# EAGLE board NN22_RPi_DetAdapter03_s00 (EAGLE 7.7.0)
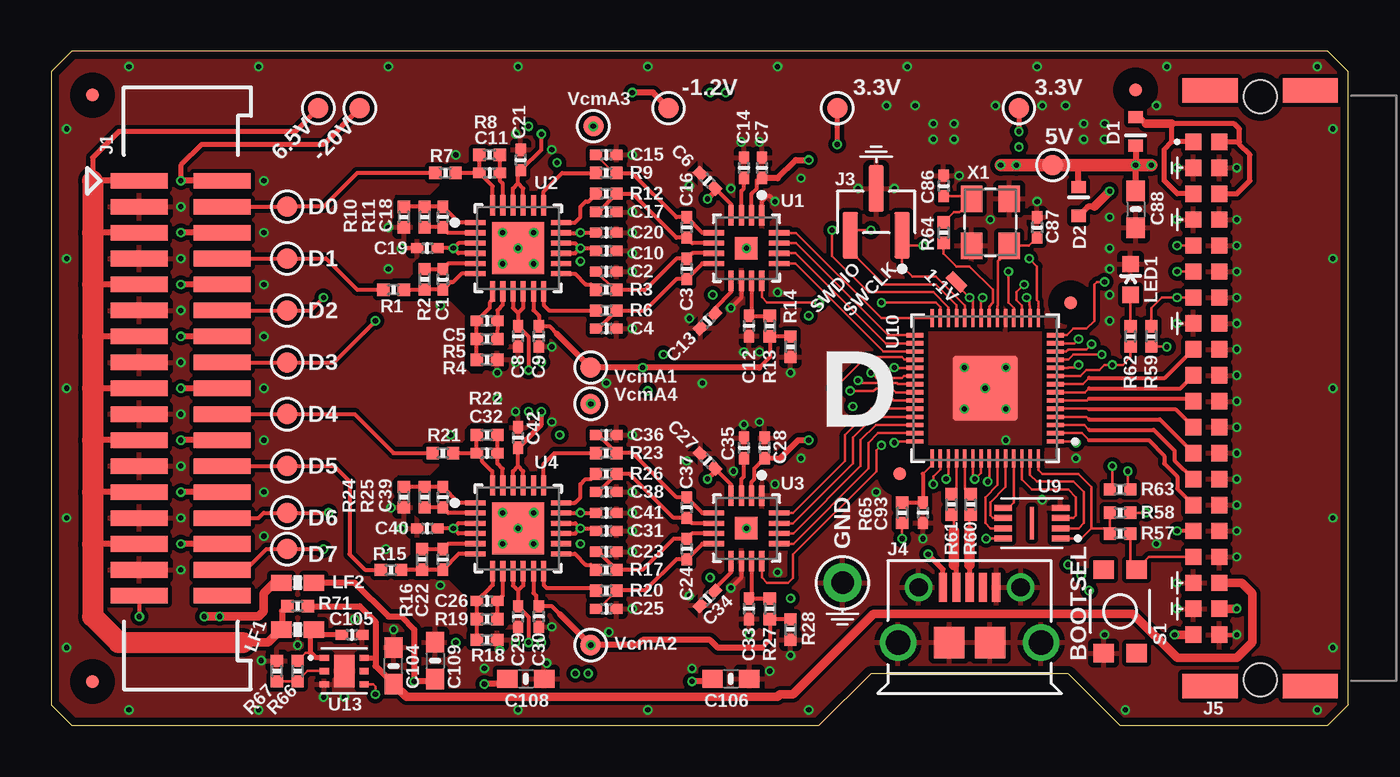
[diagram p6: board, top side]
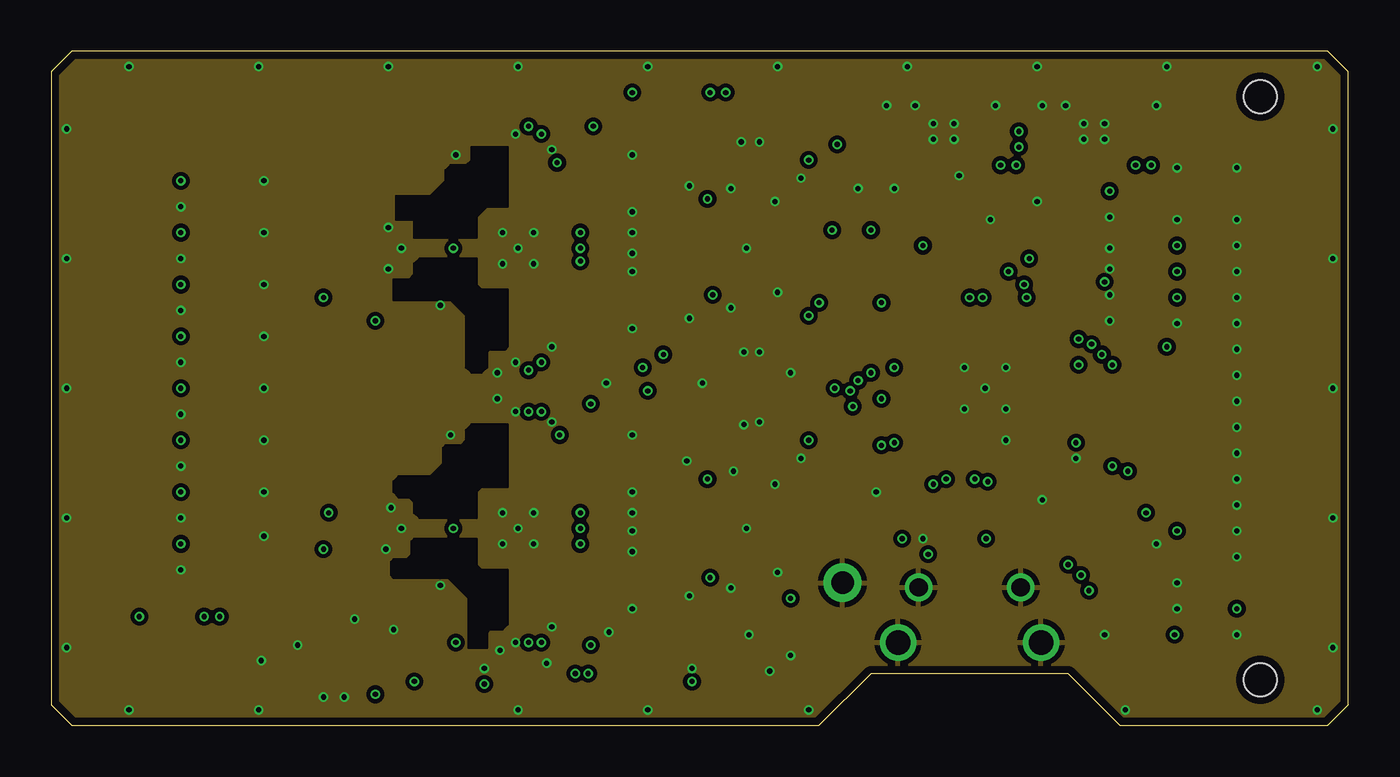
[diagram p7: board, inner layer Route2]
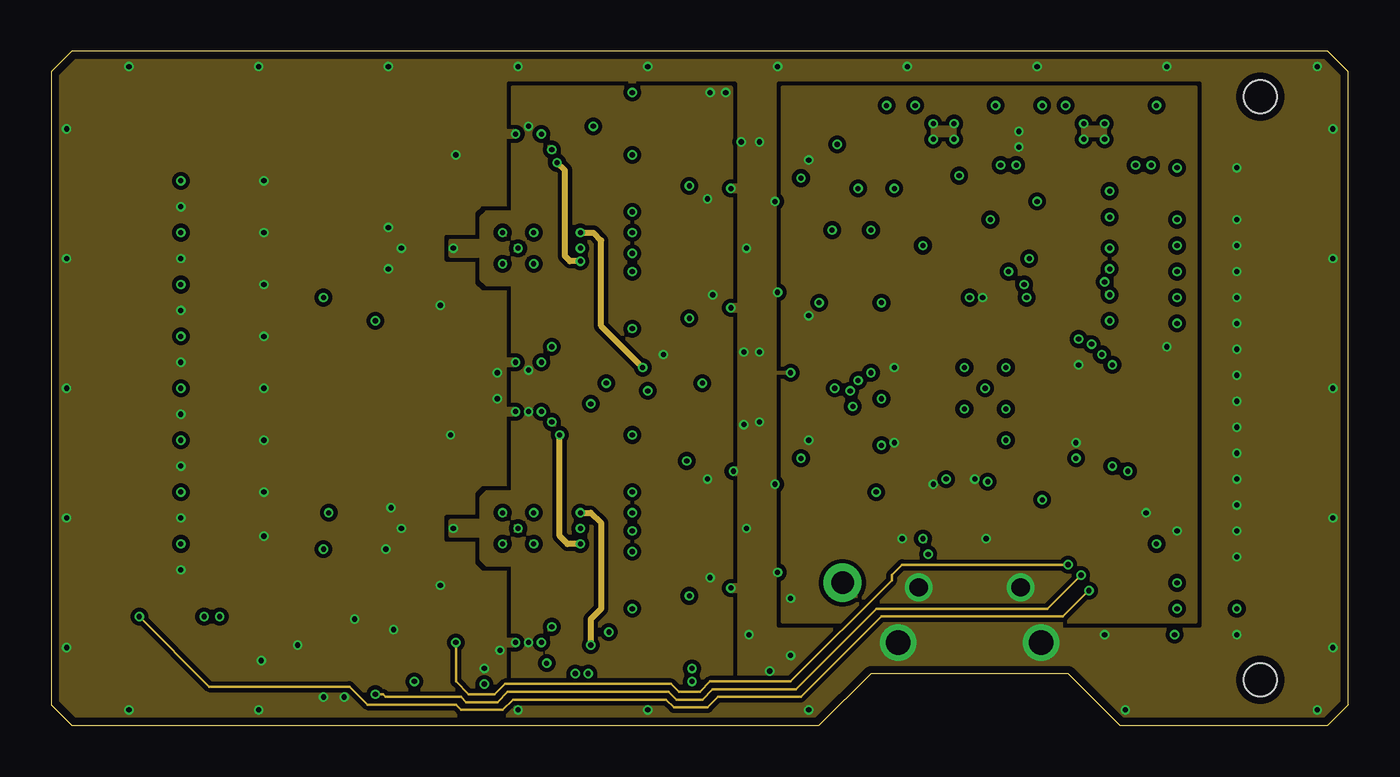
[diagram p8: board, inner layer Route3]
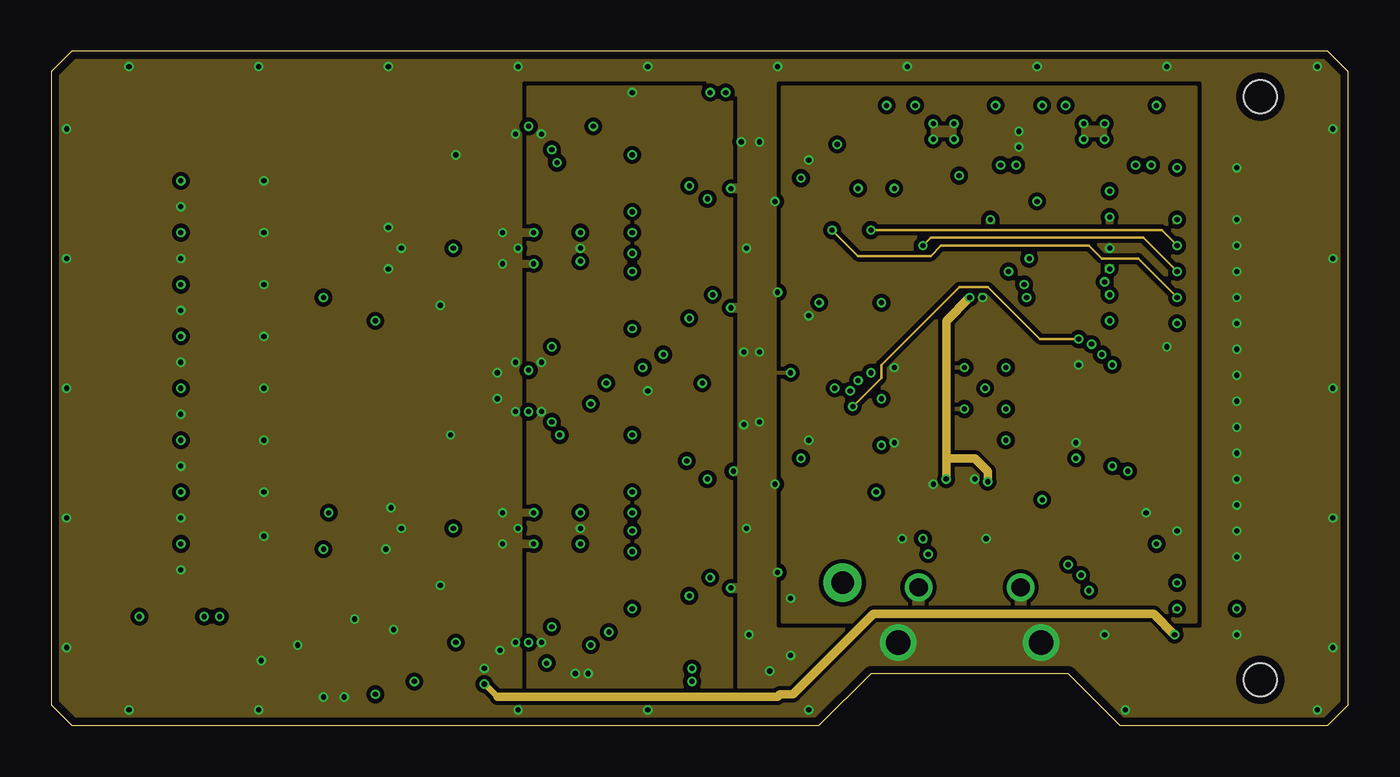
[diagram p9: board, inner layer Route14]
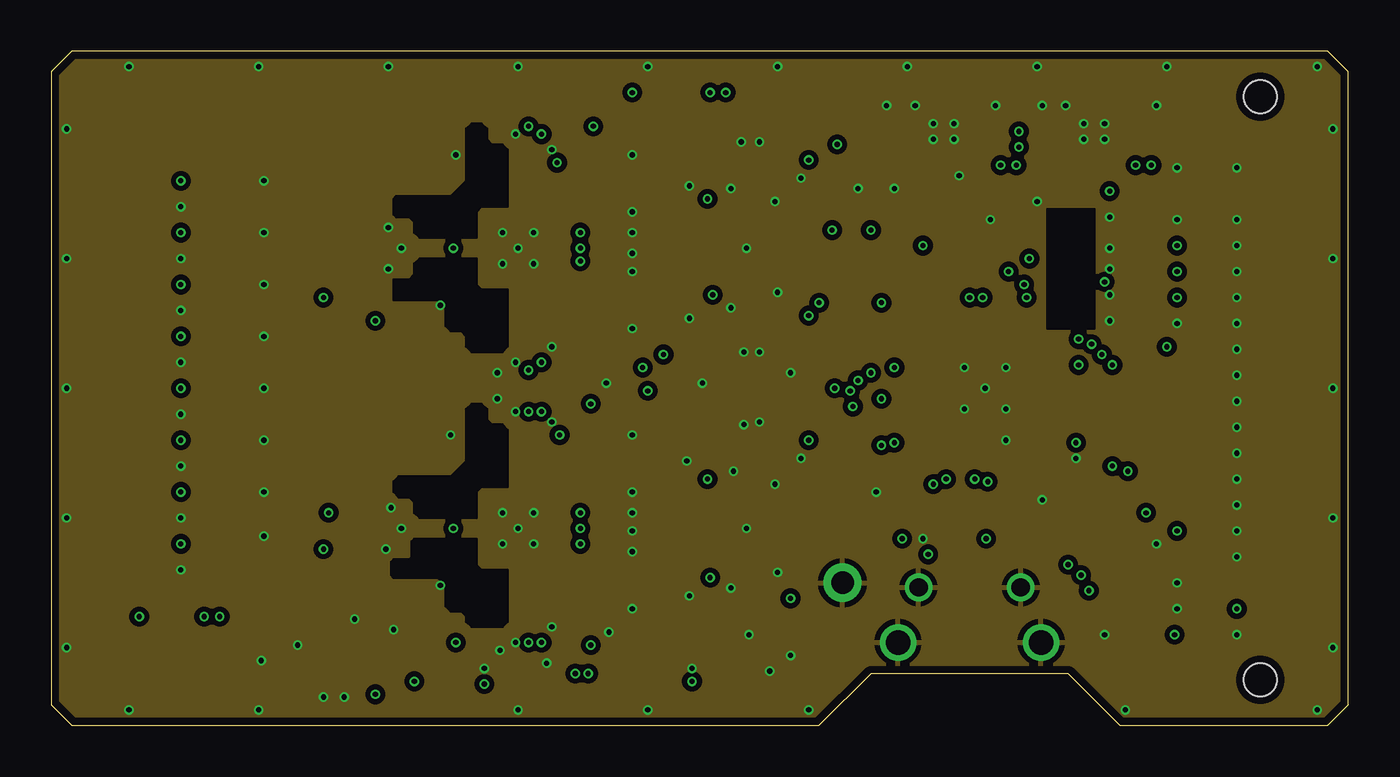
[diagram p10: board, inner layer Route15]
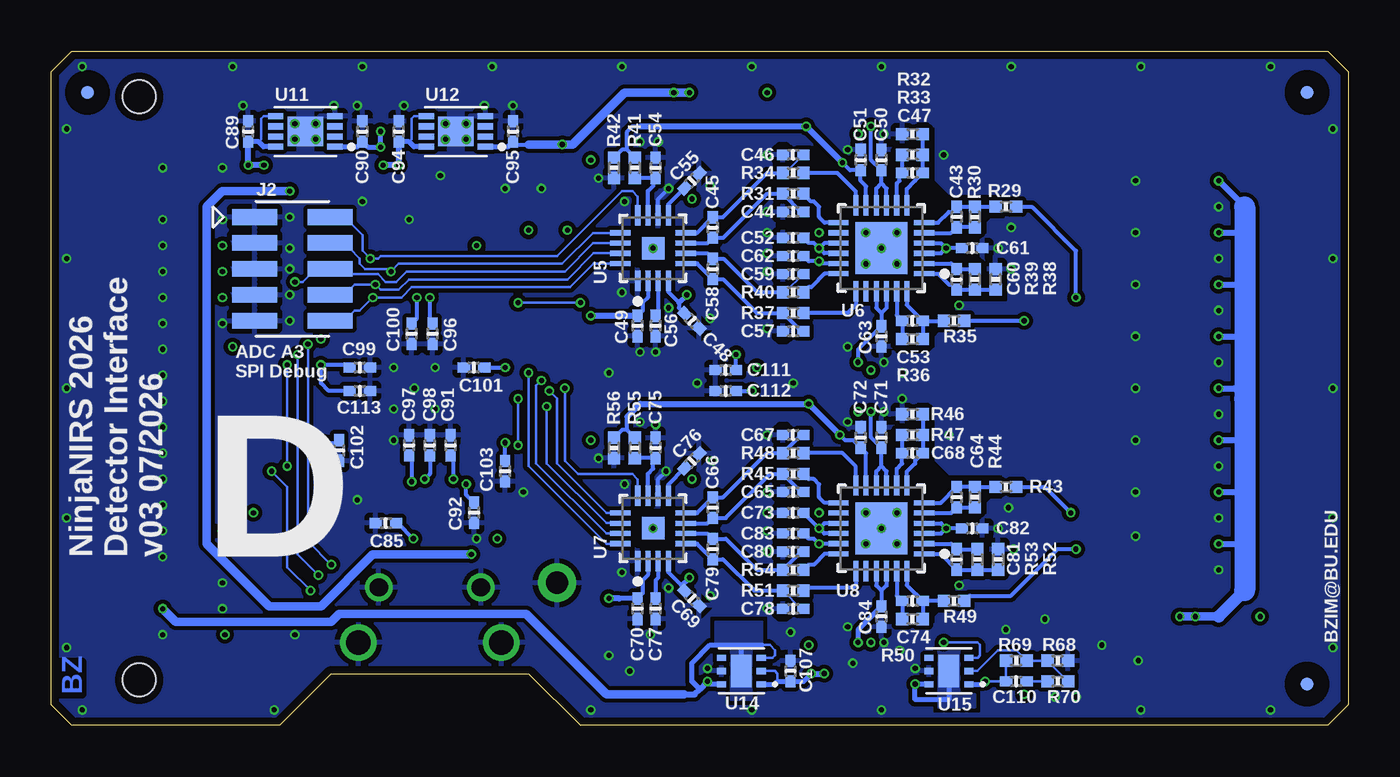
[diagram p11: board, bottom side, seen from below]

Size 63.5 x 33.02 mm. Coordinates in mm from the lower left corner, seen from the top.
Outline: 63.5,1.02 63.5,32 62.48,33.02 1.02,33.02 0,32 0,1.02 1.02,0 37.59,0 40.13,2.54 49.78,2.54 52.32,0 62.48,0 63.5,1.02
Copper layers (1*2*3*14*15*16): Top 0.04318125mm / dielectric 0.11074375mm / Route2 0.017271875mm / dielectric 4mil / Route3 0.017271875mm / dielectric 0.925575mm / Route14 0.017271875mm / dielectric 4mil / Route15 0.017271875mm / dielectric 0.11074375mm / Bottom 0.04318125mm
Design rules "oshpark-6layer *": minimum track width 5mil, minimum drill 10mil, track to track 5mil, track to pad 5mil, pad to pad 5mil, via to via 5mil, smd to smd 5mil, copper to edge 15mil, drill to drill 6mil, minimum pad ring 4mil, minimum via ring 4mil, stop-mask expansion 1.5mil, vias tented up to drill 12mil, thermal gap 10mil
tRestrict: area 35.1,24.9 to 35.1,25.1; area 23.4,19.2 to 23.5,19.4; area 24.2,19.2 to 24.3,19.4; area 27.6,23.7 to 27.8,23.8; area 27.6,24.7 to 27.8,24.7; area 27.6,25.4 to 27.8,25.5; area 21.3,21.8 to 24.4,24.9; area 33.3,22.6 to 34.8,24.1; area 21.3,8.1 to 24.4,11.2; area 33.3,8.9 to 34.8,10.4; area 57,24.1 to 57.3,24.2; area 57,22.8 to 57.3,22.9; 22 more areas
bRestrict: area 27.5,10.9 to 27.8,10.9; area 27.5,9.9 to 27.8,9.9; area 27.5,8.9 to 27.8,9; area 27.5,5.3 to 27.8,5.3; area 27.5,14.6 to 27.8,14.7; area 27.5,18.9 to 27.8,18.9; area 27.5,22.5 to 27.8,22.6; area 27.5,23.4 to 27.8,23.5; area 27.5,24.5 to 27.8,24.5; area 27.5,28.3 to 27.8,28.4; area 34.3,5.1 to 34.4,5.4; area 34.3,18.9 to 34.4,19.2; 4 more areas

## Footprints (pad centres in the part's own frame; a part is rotated, then mirrored left to right if it is on the bottom)
0402-CAP = smd 0.6 x 0.5: 1 -0.5,0; 2 0.5,0
0603-CAP = smd 1 x 0.9: 1 -0.9,0; 2 0.9,0
SOD523 = smd 0.6 x 0.7: A -0.7,0; C 0.7,0
MICRO-FIDUCIAL = smd 0.635 x 0.635: 1 0,0
M17X2_0.050_SHF = smd 2.794 x 0.762: 1 -2.032,10.16; 2 2.032,10.16; 3 -2.032,8.89; 4 2.032,8.89; 5 -2.032,7.62; 6 2.032,7.62; 7 -2.032,6.35; 8 2.032,6.35; 9 -2.032,5.08; 10 2.032,5.08; 11 -2.032,3.81; 12 2.032,3.81; 13 -2.032,2.54; 14 2.032,2.54; 15 -2.032,1.27; 16 2.032,1.27; 17 -2.032,0; 18 2.032,0; 19 -2.032,-1.27; 20 2.032,-1.27; 21 -2.032,-2.54; 22 2.032,-2.54; 23 -2.032,-3.81; 24 2.032,-3.81; 25 -2.032,-5.08; 26 2.032,-5.08; 27 -2.032,-6.35; 28 2.032,-6.35; 29 -2.032,-7.62; 30 2.032,-7.62; 31 -2.032,-8.89; 32 2.032,-8.89; 33 -2.032,-10.16; 34 2.032,-10.16
M05X2_0.050_SMD_NO_CREAM = smd 2.21 x 0.762: 1 -1.841,2.54; 2 1.841,2.54; 3 -1.841,1.27; 4 1.841,1.27; 5 -1.841,0; 6 1.841,0; 7 -1.841,-1.27; 8 1.841,-1.27; 9 -1.841,-2.54; 10 1.841,-2.54
M03X1_0.050_SMD_NO_CREAM = smd 0.762 x 2.286: 1 -1.27,1.143; 2 0,-1.143; 3 1.27,1.143
USB-MICRO = smd 0.4 x 1.4: 1 -1.3,2.7; 2 -0.65,2.7; 3 0,2.7; 4 0.65,2.7; 5 1.3,2.7 | drill 0.9: SH1 -2.5,2.7; SH2 2.5,2.7 | drill 1.2: SH3 -3.5,0; SH6 3.5,0 | smd 1.5 x 1.55: SH4 -1,0; SH5 1,0
M20X2_HARFLEX_M = smd 0.8 x 0.8: A1 12.065,2; A2 10.795,2; A3 9.525,2; A4 8.255,2; A5 6.985,2; A6 5.715,2; A7 4.445,2; A8 3.175,2; A9 1.905,2; A10 0.635,2; A11 -0.635,2; A12 -1.905,2; A13 -3.175,2; A14 -4.445,2; A15 -5.715,2; A16 -6.985,2; A17 -8.255,2; A18 -9.525,2; A19 -10.795,2; A20 -12.065,2; B1 12.065,3.27; B2 10.795,3.27; B3 9.525,3.27; B4 8.255,3.27; B5 6.985,3.27; B6 5.715,3.27; B7 4.445,3.27; B8 3.175,3.27; B9 1.905,3.27; B10 0.635,3.27; B11 -0.635,3.27; B12 -1.905,3.27; B13 -3.175,3.27; B14 -4.445,3.27; B15 -5.715,3.27; B16 -6.985,3.27; B17 -8.255,3.27; B18 -9.525,3.27; B19 -10.795,3.27; B20 -12.065,3.27 | smd 1.2 x 2.7: P$17 -14.575,2.45; P$18 -14.575,-2.45; P$19 14.575,2.45; P$20 14.575,-2.45 | hole 1.6: -14.275,0; 14.275,0
LED-0603 = smd 0.8 x 0.8: A 0,-0.75; C 0,0.75
0603-FER = smd 1 x 0.8: 1 -0.8,0; 2 0.8,0
0402-RES = smd 0.6 x 0.6: 1 -0.5,0; 2 0.5,0
TACTILE_SWITCH_SMD-3 = smd 0.9 x 1: 1 -2.05,0.8; 2 2.05,0.8; 3 -2.05,-0.8; 4 2.05,-0.8
TESTPAD_ROUND = smd 1.016 x 1.016: P$1 0,0
1X01 = drill 1.1 pad 1.88: 1 0,0
TESTPAD_SMALL = smd 1.016 x 0.508: P$1 0,0
LFCSP16 = smd 1 x 0.25: 1 -1.6,0.75; 2 -1.6,0.25; 3 -1.6,-0.25; 4 -1.6,-0.75; 9 1.6,-0.75; 10 1.6,-0.25; 11 1.6,0.25; 12 1.6,0.75 | smd 0.25 x 1: 5 -0.75,-1.6; 6 -0.25,-1.6; 7 0.25,-1.6; 8 0.75,-1.6; 13 0.75,1.6; 14 0.25,1.6; 15 -0.25,1.6; 16 -0.75,1.6 | smd 1.1 x 1.1: EP 0,0
LFCSP24 = smd 1 x 0.25: 1 -2.1,1.25; 2 -2.1,0.75; 3 -2.1,0.25; 4 -2.1,-0.25; 5 -2.1,-0.75; 6 -2.1,-1.25; 13 2.1,-1.25; 14 2.1,-0.75; 15 2.1,-0.25; 16 2.1,0.25; 17 2.1,0.75; 18 2.1,1.25 | smd 0.25 x 1: 7 -1.25,-2.1; 8 -0.75,-2.1; 9 -0.25,-2.1; 10 0.25,-2.1; 11 0.75,-2.1; 12 1.25,-2.1; 19 1.25,2.1; 20 0.75,2.1; 21 0.25,2.1; 22 -0.25,2.1; 23 -0.75,2.1; 24 -1.25,2.1 | smd 2.55 x 2.55: EP 0,0
USON8L-2X3MM_APM = smd 0.85 x 0.3: 1 -1.4,0.75; 2 -1.4,0.25; 3 -1.4,-0.25; 4 -1.4,-0.75; 5 1.4,-0.75; 6 1.4,-0.25; 7 1.4,0.25; 8 1.4,0.75 | smd 0.2 x 1.6: PAD 0,0
QFN-56_EP = smd 0.875 x 0.2: 1 -3.438,2.6; 2 -3.438,2.2; 3 -3.438,1.8; 4 -3.438,1.4; 5 -3.438,1; 6 -3.438,0.6; 7 -3.438,0.2; 8 -3.438,-0.2; 9 -3.438,-0.6; 10 -3.438,-1; 11 -3.438,-1.4; 12 -3.438,-1.8; 13 -3.438,-2.2; 14 -3.438,-2.6; 29 3.438,-2.6; 30 3.438,-2.2; 31 3.438,-1.8; 32 3.438,-1.4; 33 3.438,-1; 34 3.438,-0.6; 35 3.438,-0.2; 36 3.438,0.2; 37 3.438,0.6; 38 3.438,1; 39 3.438,1.4; 40 3.438,1.8; 41 3.438,2.2; 42 3.438,2.6 | smd 0.2 x 0.875: 15 -2.6,-3.438; 16 -2.2,-3.438; 17 -1.8,-3.438; 18 -1.4,-3.438; 19 -1,-3.438; 20 -0.6,-3.438; 21 -0.2,-3.438; 22 0.2,-3.438; 23 0.6,-3.438; 24 1,-3.438; 25 1.4,-3.438; 26 1.8,-3.438; 27 2.2,-3.438; 28 2.6,-3.438; 43 2.6,3.438; 44 2.2,3.438; 45 1.8,3.438; 46 1.4,3.438; 47 1,3.438; 48 0.6,3.438; 49 0.2,3.438; 50 -0.2,3.438; 51 -0.6,3.438; 52 -1,3.438; 53 -1.4,3.438; 54 -1.8,3.438; 55 -2.2,3.438; 56 -2.6,3.438 | smd 3.2 x 3.2: PAD 0,0
DFN8_2X3MM = smd 0.75 x 0.3: 1 -1.45,0.75; 2 -1.45,0.25; 3 -1.45,-0.25; 4 -1.45,-0.75; 5 1.45,-0.75; 6 1.45,-0.25; 7 1.45,0.25; 8 1.45,0.75 | smd 1.75 x 1.45: P 0,0
WSON6 = smd 0.45 x 0.3: 1 -0.975,0.65; 2 -0.975,0; 3 -0.975,-0.65; 4 0.975,-0.65; 5 0.975,0; 6 0.975,0.65 | smd 1 x 1.6: PAD 0,0
CRYSTAL-3.2-2.5 = smd 1.3 x 1.05: 1 -1.15,-0.925; 2 1.15,-0.925; 3 1.15,0.925; 4 -1.15,0.925

## Placement (x,y rotation side)
C1  330p  [0402-CAP]  19.18,21.84 90 top
C2  1n  [0402-CAP]  27.18,22.23 180 top
C3  1n  [0402-CAP]  31.11,22.35 270 top
C4  1n  [0402-CAP]  27.18,19.43 0 top
C5  330p  [0402-CAP]  21.34,19.81 0 top
C6  1u  [0402-CAP]  32.13,26.67 135 top
C7  1u  [0402-CAP]  34.8,27.3 90 top
C8  0.1u  [0402-CAP]  22.86,19.05 270 top
C9  0.1u  [0402-CAP]  23.88,19.05 270 top
C10  0.1u  [0402-CAP]  27.18,23.24 0 top
C11  330p  [0402-CAP]  21.46,27.05 0 top
C12  1u  [0402-CAP]  34.16,19.56 270 top
C13  0.1u  [0402-CAP]  32.13,19.81 225 top
C14  1u  [0402-CAP]  33.91,27.3 90 top
C15  1n  [0402-CAP]  27.18,27.94 180 top
C16  1n  [0402-CAP]  31.11,24.38 270 top
C17  1n  [0402-CAP]  27.18,25.15 0 top
C18  330p  [0402-CAP]  19.18,24.89 270 top
C19  0.1u  [0402-CAP]  18.41,23.37 180 top
C20  0.1u  [0402-CAP]  27.18,24.13 0 top
C21  0.1u  [0402-CAP]  22.99,27.69 90 top
C22  330p  [0402-CAP]  19.18,8.13 90 top
C23  1n  [0402-CAP]  27.18,8.51 180 top
C24  1n  [0402-CAP]  31.11,8.64 270 top
C25  1n  [0402-CAP]  27.18,5.71 0 top
C26  330p  [0402-CAP]  21.34,6.1 0 top
C27  1u  [0402-CAP]  32.13,12.95 135 top
C28  1u  [0402-CAP]  34.92,13.59 90 top
C29  0.1u  [0402-CAP]  22.86,5.33 270 top
C30  0.1u  [0402-CAP]  23.88,5.33 270 top
C31  0.1u  [0402-CAP]  27.18,9.53 0 top
C32  330p  [0402-CAP]  21.34,13.34 0 top
C33  1u  [0402-CAP]  34.16,5.71 270 top
C34  0.1u  [0402-CAP]  32.13,6.22 225 top
C35  1u  [0402-CAP]  33.91,13.59 90 top
C36  1n  [0402-CAP]  27.18,14.22 180 top
C37  1n  [0402-CAP]  31.11,10.67 270 top
C38  1n  [0402-CAP]  27.18,11.43 0 top
C39  330p  [0402-CAP]  19.18,11.18 270 top
C40  0.1u  [0402-CAP]  18.41,9.65 180 top
C41  0.1u  [0402-CAP]  27.18,10.41 0 top
C42  0.1u  [0402-CAP]  22.86,14.1 90 top
C43  330p  [0402-CAP]  19.18,24.89 270 bottom
C44  1n  [0402-CAP]  27.18,25.15 0 bottom
C45  1n  [0402-CAP]  31.11,24.38 90 bottom
C46  1n  [0402-CAP]  27.18,27.94 180 bottom
C47  330p  [0402-CAP]  21.34,27.05 180 bottom
C48  1u  [0402-CAP]  32.13,19.81 315 bottom
C49  1u  [0402-CAP]  34.8,19.56 270 bottom
C50  0.1u  [0402-CAP]  22.86,27.69 90 bottom
C51  0.1u  [0402-CAP]  23.88,27.69 90 bottom
C52  0.1u  [0402-CAP]  27.18,23.88 180 bottom
C53  330p  [0402-CAP]  21.34,19.81 180 bottom
C54  1u  [0402-CAP]  33.91,27.3 90 bottom
C55  0.1u  [0402-CAP]  32.13,26.67 45 bottom
C56  1u  [0402-CAP]  33.91,19.56 270 bottom
C57  1n  [0402-CAP]  27.18,19.3 0 bottom
C58  1n  [0402-CAP]  31.11,22.35 90 bottom
C59  1n  [0402-CAP]  27.18,22.1 180 bottom
C60  330p  [0402-CAP]  19.18,21.84 90 bottom
C61  0.1u  [0402-CAP]  18.41,23.37 0 bottom
C62  0.1u  [0402-CAP]  27.18,22.99 180 bottom
C63  0.1u  [0402-CAP]  22.86,19.05 270 bottom
C64  330p  [0402-CAP]  19.18,11.18 270 bottom
C65  1n  [0402-CAP]  27.18,11.43 0 bottom
C66  1n  [0402-CAP]  31.11,10.67 90 bottom
C67  1n  [0402-CAP]  27.18,14.22 180 bottom
C68  330p  [0402-CAP]  21.34,13.34 180 bottom
C69  1u  [0402-CAP]  32.13,6.22 315 bottom
C70  1u  [0402-CAP]  34.8,5.71 270 bottom
C71  0.1u  [0402-CAP]  22.86,14.1 90 bottom
C72  0.1u  [0402-CAP]  23.88,14.1 90 bottom
C73  0.1u  [0402-CAP]  27.18,10.41 180 bottom
C74  330p  [0402-CAP]  21.34,6.1 180 bottom
C75  1u  [0402-CAP]  33.91,13.59 90 bottom
C76  0.1u  [0402-CAP]  32.13,12.95 45 bottom
C77  1u  [0402-CAP]  33.91,5.71 270 bottom
C78  1n  [0402-CAP]  27.18,5.71 0 bottom
C79  1n  [0402-CAP]  31.11,8.64 90 bottom
C80  1n  [0402-CAP]  27.18,8.51 180 bottom
C81  330p  [0402-CAP]  19.18,8.13 90 bottom
C82  0.1u  [0402-CAP]  18.41,9.65 0 bottom
C83  0.1u  [0402-CAP]  27.18,9.4 180 bottom
C84  0.1u  [0402-CAP]  22.86,5.33 270 bottom
C85  0.1u  [0402-CAP]  47.12,9.91 180 bottom
C86  27p  [0402-CAP]  43.69,26.42 90 top
C87  27p  [0402-CAP]  48.26,24.38 90 top
C88  10u  [0603-CAP]  53.09,25.27 270 top
C89  4.7u  [0402-CAP]  53.85,29.08 90 bottom
C90  4.7u  [0402-CAP]  48.26,29.08 90 bottom
C91  4.7u  [0402-CAP]  43.94,13.72 90 bottom
C92  4.7u  [0402-CAP]  42.8,10.41 270 bottom
C93  4.7u  [0402-CAP]  42.67,10.41 270 top
C94  4.7u  [0402-CAP]  46.48,29.08 90 bottom
C95  4.7u  [0402-CAP]  40.89,29.08 90 bottom
C96  0.1u  [0402-CAP]  44.83,19.18 270 bottom
C97  0.1u  [0402-CAP]  45.97,13.72 90 bottom
C98  0.1u  [0402-CAP]  44.96,13.72 90 bottom
C99  0.1u  [0402-CAP]  48.39,17.53 0 bottom
C100  0.1u  [0402-CAP]  45.85,19.18 270 bottom
C101  0.1u  [0402-CAP]  42.8,17.53 180 bottom
C102  0.1u  [0402-CAP]  49.4,13.46 270 bottom
C103  0.1u  [0402-CAP]  41.27,12.45 270 bottom
C104  10u  [0603-CAP]  16.76,2.92 90 top
C105  4.7u  [0402-CAP]  14.73,4.45 0 top
C106  10u  [0603-CAP]  33.27,2.29 180 top
C107  4.7u  [0402-CAP]  27.3,2.67 270 bottom
C108  10u  [0603-CAP]  23.24,2.29 180 top
C109  10u  [0603-CAP]  18.8,3.17 270 top
C110  33n  [0402-CAP]  16.26,2.16 180 bottom
C111  4.7u  [0402-CAP]  30.48,17.4 180 bottom
C112  4.7u  [0402-CAP]  30.48,16.38 0 bottom
C113  4.7u  [0402-CAP]  48.39,16.38 0 bottom
D1  SBR1A20T5  [SOD523]  53.09,29.08 270 top
D2  SBR1A20T5  [SOD523]  50.29,25.65 90 top
FID1  FIDUCIALUFIDUCIAL  [MICRO-FIDUCIAL]  2.03,30.86 0 top
FID2  FIDUCIALUFIDUCIAL  [MICRO-FIDUCIAL]  2.03,2.16 0 top
FID3  FIDUCIALUFIDUCIAL  [MICRO-FIDUCIAL]  53.09,31.11 0 top
FID4  FIDUCIALUFIDUCIAL  [MICRO-FIDUCIAL]  2.03,30.99 0 bottom
FID5  FIDUCIALUFIDUCIAL  [MICRO-FIDUCIAL]  2.03,2.03 0 bottom
FID6  FIDUCIALUFIDUCIAL  [MICRO-FIDUCIAL]  61.72,30.99 0 bottom
FID7  FIDUCIALUFIDUCIAL  [MICRO-FIDUCIAL]  49.91,20.7 0 top
FID8  FIDUCIALUFIDUCIAL  [MICRO-FIDUCIAL]  41.53,12.32 0 top
J1  M17X2  [M17X2_0.050_SHF]  6.35,16.51 0 top
J2  M05X2_SMD_0.050_NOCREAM  [M05X2_0.050_SMD_NO_CREAM]  51.69,22.35 0 bottom
J3  M03X1_0.050_SMD_NO_CREAM  [M03X1_0.050_SMD_NO_CREAM]  40.39,25.15 180 top
J4  USB-MICRO  [USB-MICRO]  44.96,4.06 0 top
J5  M20X2_HARFLEX_M  [M20X2_HARFLEX_M]  59.18,16.51 90 top
LED1  [LED-0603]  52.83,21.84 0 top
LF1  FERRITE0603  [0603-FER]  12.06,4.7 0 top
LF2  FERRITE0603  [0603-FER]  12.06,6.99 0 top
R1  18k  [0402-RES]  16.76,21.34 0 top
R2  2.2k  [0402-RES]  18.29,21.84 90 top
R3  33  [0402-RES]  27.18,21.34 0 top
R4  18k  [0402-RES]  21.34,17.91 180 top
R5  2.2k  [0402-RES]  21.34,18.92 0 top
R6  33  [0402-RES]  27.18,20.32 0 top
R7  18k  [0402-RES]  19.3,27.05 0 top
R8  2.2k  [0402-RES]  21.46,27.94 0 top
R9  33  [0402-RES]  27.18,27.05 0 top
R10  18k  [0402-RES]  17.27,24.89 90 top
R11  2.2k  [0402-RES]  18.29,24.89 270 top
R12  33  [0402-RES]  27.18,26.04 0 top
R13  18k  [0402-RES]  35.18,19.56 90 top
R14  18k  [0402-RES]  36.2,18.54 90 top
R15  18k  [0402-RES]  16.64,7.62 0 top
R16  2.2k  [0402-RES]  18.16,8.13 90 top
R17  33  [0402-RES]  27.18,7.62 0 top
R18  18k  [0402-RES]  21.34,4.19 180 top
R19  2.2k  [0402-RES]  21.34,5.21 0 top
R20  33  [0402-RES]  27.18,6.6 0 top
R21  18k  [0402-RES]  19.18,13.34 0 top
R22  2.2k  [0402-RES]  21.34,14.22 0 top
R23  33  [0402-RES]  27.18,13.34 0 top
R24  18k  [0402-RES]  17.27,11.18 90 top
R25  2.2k  [0402-RES]  18.29,11.18 270 top
R26  33  [0402-RES]  27.18,12.32 0 top
R27  18k  [0402-RES]  35.18,5.71 90 top
R28  18k  [0402-RES]  36.2,4.7 90 top
R29  18k  [0402-RES]  16.76,25.4 180 bottom
R30  2.2k  [0402-RES]  18.29,24.89 270 bottom
R31  33  [0402-RES]  27.18,26.04 180 bottom
R32  18k  [0402-RES]  21.34,28.96 0 bottom
R33  2.2k  [0402-RES]  21.34,27.94 180 bottom
R34  33  [0402-RES]  27.18,27.05 180 bottom
R35  18k  [0402-RES]  19.3,19.81 180 bottom
R36  2.2k  [0402-RES]  21.34,18.92 180 bottom
R37  33  [0402-RES]  27.18,20.19 180 bottom
R38  18k  [0402-RES]  17.27,21.84 270 bottom
R39  2.2k  [0402-RES]  18.29,21.84 90 bottom
R40  33  [0402-RES]  27.18,21.21 180 bottom
R41  18k  [0402-RES]  34.92,27.3 270 bottom
R42  18k  [0402-RES]  35.94,27.3 90 bottom
R43  18k  [0402-RES]  16.76,11.68 180 bottom
R44  2.2k  [0402-RES]  18.29,11.18 270 bottom
R45  33  [0402-RES]  27.18,12.32 180 bottom
R46  18k  [0402-RES]  21.34,15.24 0 bottom
R47  2.2k  [0402-RES]  21.34,14.22 180 bottom
R48  33  [0402-RES]  27.18,13.34 180 bottom
R49  18k  [0402-RES]  19.3,6.1 180 bottom
R50  2.2k  [0402-RES]  21.34,5.21 180 bottom
R51  33  [0402-RES]  27.18,6.6 180 bottom
R52  18k  [0402-RES]  17.14,8.13 270 bottom
R53  2.2k  [0402-RES]  18.16,8.13 90 bottom
R54  33  [0402-RES]  27.18,7.62 180 bottom
R55  18k  [0402-RES]  34.92,13.59 270 bottom
R56  18k  [0402-RES]  35.94,13.59 90 bottom
R57  1.2k  [0402-RES]  52.32,9.4 180 top
R58  100k  [0402-RES]  52.32,10.41 0 top
R59  100k  [0402-RES]  53.85,19.05 270 top
R60  27  [0402-RES]  45.01,10.82 270 top
R61  27  [0402-RES]  44.07,10.82 270 top
R62  1.2k  [0402-RES]  52.83,19.05 270 top
R63  DNP  [0402-RES]  52.32,11.56 0 top
R64  1.2k  [0402-RES]  43.69,24.13 90 top
R65  33  [0402-RES]  41.66,10.41 90 top
R66  30k  [0402-RES]  12.06,2.67 90 top
R67  100k  [0402-RES]  11.05,2.67 270 top
R68  10k  [0402-RES]  14.22,3.17 0 bottom
R69  154k  [0402-RES]  16.26,3.17 0 bottom
R70  10k  [0402-RES]  14.22,2.16 0 bottom
R71  DNP  [0402-RES]  12.06,5.84 0 top
S1  SWITCH-MOMENTARY-2SMD-3  [TACTILE_SWITCH_SMD-3]  52.32,5.59 90 top
TP1  TESTPOINT_ROUND  [TESTPAD_ROUND]  11.56,22.86 0 top
TP2  TESTPOINT_ROUND  [TESTPAD_ROUND]  13.08,30.23 0 top
TP3  TESTPOINT_ROUND  [TESTPAD_ROUND]  15.11,30.23 0 top
TP4  TESTPOINT_ROUND  [TESTPAD_ROUND]  11.56,25.4 0 top
TP5  TESTPOINT_ROUND  [TESTPAD_ROUND]  26.42,17.53 0 top
TP6  TESTPOINT_ROUND  [TESTPAD_ROUND]  11.56,12.7 0 top
TP7  TESTPOINT_ROUND  [TESTPAD_ROUND]  11.56,15.24 0 top
TP8  TESTPOINT_ROUND  [TESTPAD_ROUND]  26.42,3.94 0 top
TP9  TESTPOINT_ROUND  [TESTPAD_ROUND]  11.56,20.32 0 top
TP11  TESTPOINT_ROUND  [TESTPAD_ROUND]  11.56,17.78 0 top
TP12  TESTPOINT_ROUND  [TESTPAD_ROUND]  26.54,29.34 0 top
TP13  TESTPOINT_ROUND  [TESTPAD_ROUND]  11.56,10.41 0 top
TP15  TESTPOINT_ROUND  [TESTPAD_ROUND]  11.56,8.64 0 top
TP16  TESTPOINT_ROUND  [TESTPAD_ROUND]  26.42,15.75 0 top
TP17  TESTPOINT_ROUND  [TESTPAD_ROUND]  47.37,30.23 0 top
TP18  TESTPOINT_ROUND  [TESTPAD_ROUND]  38.48,30.23 0 top
TP19  TESTPOINT_ROUND  [TESTPAD_ROUND]  30.23,30.23 0 top
TP20  TESTPOINT1X01  [1X01]  38.73,6.99 0 top
TP21  TESTPOINTPADSMALL  [TESTPAD_SMALL]  44.32,21.72 135 top
TP22  TESTPOINT_ROUND  [TESTPAD_ROUND]  49.02,27.43 0 top
U1  AD7380  [LFCSP16]  34.04,23.37 270 top
U2  ADA4940-2  [LFCSP24]  22.86,23.37 0 top
U3  AD7380  [LFCSP16]  34.04,9.65 270 top
U4  ADA4940-2  [LFCSP24]  22.86,9.65 0 top
U5  AD7380  [LFCSP16]  34.04,23.37 90 bottom
U6  ADA4940-2  [LFCSP24]  22.86,23.37 180 bottom
U7  AD7380  [LFCSP16]  34.04,9.65 90 bottom
U8  ADA4940-2  [LFCSP24]  22.86,9.65 180 bottom
U9  W25Q_USON_PAD  [USON8L-2X3MM_APM]  48.01,9.91 180 top
U10  RP2040  [QFN-56_EP]  45.72,16.51 180 top
U11  MCP1755_DFN  [DFN8_2X3MM]  51.05,29.08 180 bottom
U12  MCP1755_DFN  [DFN8_2X3MM]  43.69,29.08 180 bottom
U13  ADP7142_WSON  [WSON6]  14.35,2.67 0 top
U14  ADP7182_WSON  [WSON6]  29.72,2.67 180 bottom
U15  ADP7182_WSON  [WSON6]  19.56,2.67 180 bottom
X1  CRYSTAL-3.2-2.5  [CRYSTAL-3.2-2.5]  45.97,24.64 270 top

## Tracks (layer width: path | path; a pad name or v marks a point on that pad's centre or on a via)
/CS_A1  (via drill 0.25)
  Top 0.127: U1.12 34.79,20.97 35.05,20.7 v37.59,20.7 | U10.27 43.52,20.49 43.31,20.7 v40.64,20.7
  Bottom 0.127: v40.64,20.7 v37.59,20.7
/CS_A2  (via drill 0.25)
  Top 0.127: U3.12 34.79,7.25 35.05,6.99 36.07,6.99 36.32,7.24 36.32,8.38 40.39,12.45 40.39,13.46 v40.64,13.72 | U10.37 41.24,15.91 41.15,16 v40.64,16
  Bottom 0.127: v40.64,13.72 v40.64,16
/CS_A3  (via drill 0.25)
  Top 0.127: U10.15 48.32,20.77 48.26,20.83 48.26,22.48 v47.88,22.86
  Bottom 0.127: U5.12 34.79,25.9 35.05,26.16 35.56,26.16 38.73,22.99 47.37,22.99 47.5,22.86 v47.88,22.86 48.26,23.24 48.26,24 48.9,24.64 49.59,24.64 J2.2
/CS_A4  (via drill 0.25)
  Top 0.127: U10.32 41.78,17.91 41.66,18.03 39.88,18.03 v38.35,16.51
  Bottom 0.127: U7.12 34.79,12.05 35.05,12.32 37.72,12.32 38.35,12.95 v38.35,16.51
A_COMM  (via drill 0.25)
  Top 0.127: R63.2 52.7,11.68 v52.7,12.45
  Top 0.203: J1.33 v4.32,5.33
  Route3 0.127: v4.32,5.33 7.75,1.91 14.61,1.91 15.49,1.02 19.81,1.02 20.07,0.76 22.1,0.76 22.61,1.27 30.1,1.27 30.48,0.89 32.13,0.89 32.64,1.4 36.7,1.4 40.64,5.33 49.53,5.33 v50.8,6.6
  Bottom 0.127: v52.7,12.45 51.94,11.68 51.94,7.75 v50.8,6.6
BOOTSEL
  Top 0.127: J5.B17 53.74,8.26 S1.4 52.82,7.94 R57.1
DET0
  Top 0.203: J1.4 TP4.P$1 13.34,25.4 14.99,27.05 R7.1
DET1
  Top 0.203: J1.8 TP1.P$1 13.46,22.86 14.99,21.34 R1.1
DET2  (via drill 0.25)
  Top 0.203: J1.12 TP9.P$1 12.7,20.32 v13.34,20.95
  Bottom 0.203: v13.34,20.95 13.34,23.23 15.5,25.4 R29.1
DET3  (via drill 0.25)
  Top 0.203: J1.16 TP11.P$1 13.84,17.78 v15.88,19.81
  Bottom 0.203: v15.88,19.81 R35.1
DET4
  Top 0.203: J1.20 TP7.P$1 14.86,15.24 16.76,13.34 R21.1
DET5
  Top 0.203: J1.24 TP6.P$1 13.84,12.7 14.61,11.94 14.61,8.38 15.37,7.62 R15.1
DET6  (via drill 0.25)
  Top 0.203: v13.59,10.41 TP13.P$1 10.41,10.41 10.16,10.16 J1.28
  Bottom 0.203: R43.1 14.86,11.68 v13.59,10.41
DET7  (via drill 0.25)
  Top 0.203: v13.34,8.64 TP15.P$1 10.54,8.64 9.53,7.62 J1.32
  Bottom 0.203: R49.1 18.54,6.35 16.51,6.35 14.22,8.64 v13.34,8.64
GND  (via drill 0.25)
  Top 0.203: U1.10 33.79,20.96 v33.27,20.45 | U3.10 33.79,7.24 v33.27,6.73 | C61.2 v17.14,23.37 | U1.1 34.79,25.64 35.05,25.91 35.18,25.91 v35.43,25.65 | J5.A20 v58.04,4.45
  Bottom 0.203: U5.10 33.79,25.78 v33.27,26.29 | U7.10 33.79,12.06 v33.4,12.45
  other vias: 6.35,7.62 6.35,10.16 6.35,12.7 6.35,15.24 6.35,17.78 6.35,20.32 6.35,22.86 6.35,25.4 28.45,22.23 28.45,23.11 28.45,24.13 28.45,25.15 28.45,27.94 28.45,19.43 22.73,17.78 24.51,18.54 21.84,17.27 16.51,24.38 22.73,28.96 10.16,32.26 33.91,18.29 34.67,18.29 31.24,26.42 33.78,28.57 34.67,28.57 22.1,24.13 23.62,24.13 23.62,22.61 22.1,22.61 22.86,23.37 34.04,23.37 52.58,0.76 51.82,23.37 58.04,20.95 27.18,16.76 3.81,0.76 61.98,0.76 58.04,22.23 16.51,22.35 36.7,26.8 35.56,21.21 31.24,19.94 36.2,17.27 24.51,28.19 34.04,9.65 28.45,11.43 28.45,10.41 28.45,9.53 28.45,8.51 28.45,5.71 28.45,14.22 16.38,8.64 17.14,9.65 16.64,10.67 21.97,3.68 22.73,4.06 24.51,4.83 22.73,15.37 21.84,16 24.51,14.86 22.86,9.65 23.62,10.41 22.1,10.41 22.1,8.89 23.62,8.89 36.2,3.43 34.16,4.45 31.24,6.35 31.11,12.95 35.43,11.81 35.56,7.49 33.91,14.73 34.67,14.86 36.7,13.08 55.12,24.77 58.04,15.88 58.04,13.34 48.51,11.05 51.82,24.89 50.55,29.46 51.56,29.46 51.56,28.7 50.55,28.7 49.66,30.35 54.1,30.35 48.51,30.35 46.23,30.35 40.89,30.35 42.29,30.35 43.18,29.46 44.2,28.7 44.2,29.46 43.18,28.7 35.18,2.67 31.37,2.79 27.3,4.57 16.76,4.7 14.86,5.21 14.35,1.4 13.34,1.4 10.29,3.17 10.16,0.76 19.05,6.86 22.86,0.76 29.21,0.76 37.08,0.76 21.21,2.79 24.26,3.05 58.04,9.53 58.04,8.26 55.12,5.71 55.12,6.99 55.12,19.68 58.04,27.3 51.56,4.45 44.7,17.53 46.74,17.53 46.74,15.49 44.7,15.49 42.67,9.14 51.82,22.35 51.82,21.08 48.26,25.65 44.45,26.92 45.97,24.77 41.27,26.29 39.5,26.29 46.74,13.97 40.39,11.43 55.12,27.3 58.04,24.77 58.04,23.5 58.04,19.68 58.04,18.41 58.04,17.14 58.04,14.61 58.04,12.06 58.04,10.79 3.81,32.26 16.51,32.26 22.86,32.26 29.21,32.26 35.56,32.26 41.91,32.26 48.26,32.26 54.61,32.26 61.98,32.26 0.76,3.81 0.76,10.16 0.76,16.51 0.76,22.86 0.76,29.21 10.41,26.67 10.41,24.13 10.41,21.59 10.41,19.05 10.41,16.51 10.41,13.97 10.41,11.43 10.41,9.27 62.74,3.81 62.74,10.16 62.74,16.51 62.74,22.86 62.74,29.21 31.88,16.76 50.16,13.08 54.1,8.89 19.81,27.94 19.05,20.57 19.56,14.22 12.06,3.94 51.82,19.81 45.72,16.51
  pour Route2 (isolate 0.203, rank 6): 0,0 63.5,0 63.5,33.02 0,33.02
  pour Route15 (isolate 0.254, rank 6): 0,0 63.5,0 63.5,33.02 0,33.02
  pour Top (isolate 0.254, rank 2, no thermals): 13.84,3.94 14.86,3.94 14.86,1.14 13.84,1.14
  pour Top (isolate 0.203, rank 6): 0,33.02 63.5,33.02 63.5,0 0,0
  pour Bottom (isolate 0.203, rank 6): 0,33.02 63.5,33.02 63.5,0 0,0
  pour Bottom (isolate 0.203, no thermals): 43.31,30.23 44.07,30.23 44.07,27.94 43.31,27.94
  pour Bottom (isolate 0.203, no thermals): 50.67,30.23 50.67,27.94 51.44,27.94 51.44,30.23
  cutout Route15: 48.77,25.27 51.05,25.27 51.05,19.43 48.77,19.43
  pour Top (isolate 0.203, no thermals): 43.18,19.05 48.26,19.05 48.26,13.97 43.18,13.97
  pour Route3 (isolate 0.203, rank 6, no thermals): 0,33.02 63.5,33.02 63.5,0 0,0
  pour Route14 (isolate 0.203, rank 6, no thermals): 0,33.02 63.5,33.02 63.5,0 0,0
GPIO00
  Top 0.127: U10.2 50.46,14.31 50.8,13.97
  Top 0.203: 50.8,13.97 53.72,13.97 54.48,13.21 54.48,12.83 55.12,12.19 55.12,11.59 J5.B15
GPIO01
  Top 0.127: U10.3 50.57,14.71 50.8,14.48
  Top 0.203: 50.8,14.48 53.98,14.48 54.99,13.46 54.99,12.99 J5.B14
GPIO02
  Top 0.127: U10.4 50.68,15.11 50.8,14.99
  Top 0.203: 50.8,14.99 54.26,14.99 J5.B13
GPIO03
  Top 0.127: U10.5 50.78,15.51 50.8,15.49
  Top 0.203: 50.8,15.49 55.02,15.49 J5.B12
GPIO04
  Top 0.127: U10.6 50.71,15.91 50.8,16
  Top 0.203: 50.8,16 55.78,16 J5.B11
GPIO05
  Top 0.127: U10.7 50.6,16.31 50.8,16.51
  Top 0.203: 50.8,16.51 55.28,16.51 J5.B10
GPIO06
  Top 0.127: U10.8 50.49,16.71 50.8,17.02
  Top 0.203: 50.8,17.02 54.52,17.02 J5.B9
LED  (via drill 0.25)
  Top 0.127: U10.9 50.38,17.11 50.67,17.4 51.31,17.4 51.56,17.65 v51.94,17.65 52.45,17.65 52.83,18.03 R62.2 | v51.94,12.7 51.94,11.68 R63.1
  Bottom 0.127: v51.94,17.65 v51.94,12.7
N$1
  Top 0.203: U2.13 25.63,22.12 26.16,21.59 26.42,21.59 R3.1
N$2
  Top 0.203: U2.12 24.11,20.59 24.38,20.32 R6.1
N$3
  Top 0.152: 27.57,21.34 C2.2
  Top 0.203: U1.7 31.38,23.12 C3.1 30.61,22.85 29.09,21.34 R3.2 27.57,21.34
N$4
  Top 0.203: U1.8 31.88,22.62 C3.2 30.61,21.85 29.07,20.32 R6.2 26.79,19.43 C4.1
N$5
  Top 0.203: R8.2 C11.2 21.96,26.68 22.1,26.54 22.1,25.48 U2.23
N$6
  Top 0.203: R13.2 C12.1 34.29,20.18 U1.11
N$7
  Top 0.203: U1.9 33.29,21.22 32.48,20.42 C13.1
N$8
  Top 0.203: 33.79,26.67 C14.1 | 33.79,26.8 C14.1 | U1.3 33.79,26.17 33.91,26.29 C14.1
N$9
  Top 0.203: U2.2 20.75,24.13 19.43,24.13 C18.2 R11.2
N$10
  Top 0.203: U4.13 25.63,8.4 26.16,7.87 26.42,7.87 R17.1
N$11
  Top 0.203: U2.19 24.11,26.14 25.02,27.05 R9.1
N$12
  Top 0.203: U2.18 25.63,24.62 25.91,24.89 25.91,25.4 26.16,25.65 26.3,25.65 R12.1
N$13
  Top 0.127: 26.79,27.81 27.55,27.05
  Top 0.203: C15.2 26.79,27.81 | U1.5 31.88,24.12 C16.1 30.61,24.88 28.44,27.05 R9.2 27.55,27.05
N$14
  Top 0.203: C17.1 26.79,25.15 R12.2 28.46,26.04 30.61,23.88 C16.2 31.38,23.62 U1.6
N$15
  Top 0.203: U4.12 24.11,6.88 24.26,6.73 26.55,6.73 R20.1
N$16
  Top 0.127: C87.1 47.86,23.49 X1.3 46.48,23.07 46.48,22.86 46.35,22.73 46.35,20.57 46.32,20.54 U10.20
N$17
  Top 0.127: R64.2 44.2,25.15 44.45,25.15 44.7,25.4 44.7,25.44 X1.1 | 44.93,25.91 X1.1 | C86.1 44.92,25.92 X1.1
N$18
  Top 0.127: R64.1 43.69,23.11 44.32,22.48 44.96,22.48 46.1,21.34 46.1,20.7 45.92,20.52 U10.21
N$19
  Top 0.203: U2.6 20.09,22.12 19.68,21.72 19.56,21.72 C1.1 R2.1 R1.2
N$20
  Top 0.203: U2.5 19.45,22.62 C1.2 R2.2
N$21
  Top 0.203: U2.8 22.11,20.59 21.84,20.32 C5.2 | C5.2 R5.2 | C5.2
N$22
  Top 0.203: U2.7 21.61,20.85 21.46,20.7 21.46,20.44 C5.1 R5.1 R4.2
N$23
  Top 0.203: U2.24 21.61,26.4 C11.1 | C11.1 R7.2 | C11.1 R8.1
N$24
  Top 0.203: U2.1 20.74,24.64 19.94,24.64 C18.1 R11.1 R10.2
N$25
  Top 0.203: U3.7 31.38,9.4 C24.1 30.47,9.14 28.96,7.62 R17.2 26.79,8.51 C23.2
N$26
  Top 0.127: C25.1 26.8,5.71 27.18,6.1 R20.2
  Top 0.203: U3.8 31.88,8.9 C24.2 30.61,8.14 29.08,6.6 R20.2 27.57,6.6
N$27
  Bottom 0.127: U15.2 18.16,2.67 17.14,3.68 16.26,3.68 15.76,3.18 R69.2 R68.1 13.72,2.17 R70.2
N$28
  Top 0.127: U13.2 12.56,2.67 R66.1 R67.2
N$29
  Top 0.127: U10.47 44.72,11.58 R60.1
N$30
  Top 0.127: U10.46 44.32,11.55 R61.1
N$31
  cutout Top (isolate 0.203, no thermals): 20.83,23.88 17.78,23.88 17.78,24.77 16.89,24.77 16.89,25.91 18.54,25.91 19.3,26.67 19.3,27.18 19.56,27.43 20.32,27.43 20.57,27.69 20.57,28.32 22.35,28.32 22.35,25.4 21.34,25.4 20.83,24.89
N$32
  Top 0.203: U3.11 34.29,6.34 C33.1 R27.2
N$33
  Top 0.203: U3.9 33.29,7.5 32.48,6.7 C34.1
N$34
  Top 0.203: U3.3 33.79,12.07 33.91,12.19 C35.1
N$35
  Top 0.127: R61.2 44.2,10.29 44.2,9.53
  Top 0.254: J4.2 44.31,7.76 44.2,7.87
  Top 0.508: 44.2,9.53 44.2,7.87
N$37
  Top 0.127: 44.96,9.53 44.96,10.37 R60.2
  Top 0.254: 44.96,7.87 J4.3
  Top 0.508: 44.96,9.53 44.96,7.87
N$39
  Top 0.203: U4.19 24.11,12.81 24.64,13.34 R23.1
N$40
  Top 0.203: U4.18 25.63,10.9 25.91,11.18 25.91,11.81 26.16,12.06 26.42,12.06 R26.1
N$41
  Top 0.203: U3.5 31.88,10.4 C37.1 30.61,11.17 28.45,13.34 R23.2 26.79,14.22 C36.2
N$42
  Top 0.203: U3.6 31.38,9.9 C37.2 30.47,10.17 28.32,12.32 R26.2 26.79,11.43 C38.1
N$43
  Top 0.127: U10.43 43.12,12.77 42.67,12.32
  Top 0.203: R65.2 C93.1 42.67,12.32
N$44
  cutout Route2 (isolate 0.203, no thermals): 22.35,28.32 22.35,25.4 21.34,25.4 20.83,24.89 20.83,23.88 17.78,23.88 17.78,24.77 16.89,24.77 16.89,25.91 18.54,25.91 19.3,26.67 19.3,27.18 19.56,27.43 20.32,27.43 20.57,27.69 20.57,28.32
N$45
  Top 0.203: U4.6 19.95,8.4 C22.1 R16.1 R15.2
N$46
  Top 0.203: U4.5 19.45,8.9 C22.2 R16.2
N$47
  Top 0.203: U4.8 22.11,6.37 C26.2 R19.2
N$48
  Top 0.203: U4.7 21.61,6.88 21.46,6.73 21.46,6.72 C26.1 R19.1 R18.2
N$49
  Top 0.203: C32.1 21.08,13.09 21.08,12.95 21.59,12.45 21.59,11.77 U4.24 | C32.1 R22.1 | R21.2 C32.1
N$50
  Top 0.203: U4.1 19.95,10.9 C39.1 R25.1 R24.2
N$51
  Top 0.203: U4.23 22.11,12.56 21.84,12.83 21.84,13.33 C32.2 R22.2
N$52
  Top 0.203: U4.2 19.45,10.4 C39.2 R25.2
N$53
  cutout Top: 20.83,22.86 18.03,22.86 17.78,22.61 17.78,22.1 17.53,21.84 16.76,21.84 16.76,20.83 19.56,20.83 20.32,20.07 20.32,17.53 20.57,17.27 21.08,17.27 21.34,17.53 21.34,18.29 21.46,18.41 22.23,18.41 22.35,18.54 22.35,21.34 21.08,21.34 20.83,21.59
N$54
  cutout Route2: 20.83,22.86 18.03,22.86 17.78,22.61 17.78,22.1 17.53,21.84 16.76,21.84 16.76,20.83 19.56,20.83 20.32,20.07 20.32,17.53 20.57,17.27 21.08,17.27 21.34,17.53 21.34,18.29 21.46,18.41 22.23,18.41 22.35,18.54 22.35,21.34 21.08,21.34 20.83,21.59
N$55
  Bottom 0.203: U6.13 25.63,24.62 25.91,24.89 25.91,25.4 26.16,25.65 26.3,25.65 R31.1
N$56
  Bottom 0.203: U6.12 24.11,26.14 25.02,27.05 R34.1
N$57
  Bottom 0.203: U5.7 31.38,23.62 C45.1 30.6,23.88 28.45,26.04 R31.2 26.79,25.15 C44.2
N$58
  Bottom 0.127: C46.1 27.57,27.05
  Bottom 0.203: U5.8 31.88,24.12 C45.2 30.61,24.88 28.45,27.05 R34.2 27.57,27.05
N$59
  Bottom 0.203: U5.11 34.29,26.17 34.04,26.42 34.04,26.68 C54.1 R41.2
N$60
  Bottom 0.203: U5.9 33.29,25.52 C55.1
N$61
  Bottom 0.203: U5.3 33.79,20.18 C56.1
N$62
  Bottom 0.203: U6.19 24.11,20.59 24.51,20.19 R37.1
N$63
  Bottom 0.203: U6.18 25.63,22.12 26.29,21.46 26.42,21.46 R40.1
N$64
  Bottom 0.203: U5.5 31.88,22.62 C58.1 30.61,21.85 28.96,20.19 R37.2 26.79,19.3 C57.2
N$65
  Bottom 0.127: C59.1 27.57,21.21
  Bottom 0.203: U5.6 31.38,23.12 C58.2 30.6,22.85 28.96,21.21 R40.2 27.57,21.21
N$66
  cutout Top: 22.35,14.73 22.35,11.68 21.08,11.68 20.83,11.43 20.83,10.16 18.03,10.16 17.78,10.41 17.78,10.92 17.53,11.18 17.02,11.18 16.76,11.43 16.76,11.94 17.02,12.19 18.54,12.19 19.18,12.83 19.18,13.59 19.3,13.72 20.07,13.72 20.32,13.97 20.32,14.48 20.57,14.73
N$67
  cutout Route2: 22.35,14.73 22.35,11.68 21.08,11.68 20.83,11.43 20.83,10.16 18.03,10.16 17.78,10.41 17.78,10.92 17.53,11.18 17.02,11.18 16.76,11.43 16.76,11.94 17.02,12.19 18.54,12.19 19.18,12.83 19.18,13.59 19.3,13.72 20.07,13.72 20.32,13.97 20.32,14.48 20.57,14.73
N$68
  Bottom 0.203: U6.6 20.09,24.62 19.56,25.15 19.42,25.15 C43.1 R30.1 17.27,25.39 R29.2
N$69
  Bottom 0.203: U6.5 19.45,24.12 C43.2 R30.2
N$70
  Bottom 0.203: U6.8 22.11,26.53 21.97,26.67 21.97,26.92 C47.2 | 21.97,27.04 C47.2 | C47.2 R33.2
N$71
  Bottom 0.203: U6.7 21.61,26.27 21.21,26.67 21.21,26.68 C47.1 R33.1 R32.2
N$72
  Bottom 0.203: U6.24 21.61,20.59 C53.1 | C53.1 R36.1 | C53.1 R35.2
N$73
  Bottom 0.203: U6.1 20.09,22.12 19.56,21.59 19.42,21.59 C60.1 R39.1 R38.2
N$74
  Bottom 0.203: U6.23 22.11,20.09 C53.2 R36.2
N$75
  Bottom 0.203: U6.2 19.45,22.62 C60.2 R39.2
N$76
  cutout Top: 20.83,9.14 20.83,7.87 21.08,7.62 22.35,7.62 22.35,4.95 22.1,4.7 21.46,4.7 21.34,4.57 21.34,3.81 20.45,3.81 20.45,6.22 19.43,7.24 16.76,7.24 16.64,7.37 16.64,8 16.76,8.13 17.4,8.13 17.65,8.38 17.65,9.02 17.78,9.14
N$77
  cutout Route2: 20.83,9.14 20.83,7.87 21.08,7.62 22.35,7.62 22.35,4.95 22.1,4.7 21.46,4.7 21.34,4.57 21.34,3.81 20.45,3.81 20.45,6.22 19.43,7.24 16.76,7.24 16.64,7.37 16.64,8 16.76,8.13 17.4,8.13 17.65,8.38 17.65,9.02 17.78,9.14
N$78
  Bottom 0.203: U8.13 25.63,10.9 25.91,11.18 25.91,11.81 26.16,12.06 26.42,12.06 R45.1
N$79
  Bottom 0.203: U8.12 24.11,12.68 24.77,13.34 R48.1
N$80
  Bottom 0.203: U7.7 31.38,9.9 C66.1 30.49,10.17 30.48,10.16 28.32,12.32 R45.2 26.79,11.43 C65.2
N$81
  Bottom 0.203: U7.8 31.88,10.4 C66.2 30.61,11.17 28.45,13.34 R48.2 26.79,14.22 C67.1
N$82
  Bottom 0.203: U7.11 34.29,12.32 34.04,12.57 34.04,12.96 C75.1 R55.2
N$83
  Bottom 0.203: U7.9 33.29,11.8 C76.1
N$84
  Bottom 0.203: U7.3 33.79,7.24 33.91,7.11 C77.1
N$85
  Bottom 0.203: U8.19 24.11,6.88 24.26,6.73 26.55,6.73 R51.1
N$86
  Bottom 0.203: U8.18 25.63,8.4 26.16,7.87 26.42,7.87 R54.1
N$87
  Bottom 0.127: C78.2 26.79,5.71 R51.2
  Bottom 0.203: U7.5 31.88,8.9 C79.1 30.61,8.14 29.08,6.6 R51.2 27.57,6.6
N$88
  Bottom 0.203: U7.6 31.38,9.4 C79.2 30.47,9.14 28.96,7.62 R54.2 26.79,8.51 C80.1
N$91
  Bottom 0.203: U8.6 19.95,10.9 C64.1 R44.1 17.27,11.68 R43.2
N$92
  Bottom 0.203: U8.5 19.45,10.4 C64.2 R44.2
N$93
  Bottom 0.203: U8.8 22.11,12.56 21.84,12.83 21.84,13.33 C68.2 R47.2
N$94
  Bottom 0.203: U8.7 21.61,12.43 21.21,12.83 21.21,12.96 C68.1 R47.1 R46.2
N$95
  Bottom 0.203: U8.24 21.61,6.87 C74.1 | C74.1 R50.1 | R49.2 C74.1
N$96
  Bottom 0.203: U8.1 19.95,8.4 C81.1 R53.1 R52.2
N$97
  Bottom 0.203: U8.23 22.11,6.37 C74.2 R50.2
N$98
  Bottom 0.203: U8.2 19.45,8.9 C81.2 R53.2
N$99
  cutout Bottom: 20.83,24.89 20.83,23.88 18.03,23.88 17.78,24.13 17.78,24.64 17.53,24.89 16.89,24.89 16.76,25.02 16.76,25.78 16.89,25.91 19.56,25.91 20.32,26.67 20.32,29.21 20.57,29.46 21.08,29.46 21.34,29.21 21.34,28.7 21.59,28.45 22.1,28.45 22.35,28.19 22.35,25.4 21.08,25.4 20.83,25.15
N$100
  cutout Bottom: 20.83,22.86 18.03,22.86 17.78,22.61 17.78,22.1 17.53,21.84 16.76,21.84 16.76,20.83 19.05,20.83 19.3,20.57 19.3,19.56 19.56,19.3 20.07,19.3 20.32,19.05 20.32,18.54 20.57,18.29 22.1,18.29 22.35,18.54 22.35,21.34 21.08,21.34 20.83,21.59
N$101
  cutout Bottom: 22.35,11.68 22.35,14.48 22.1,14.73 21.59,14.73 21.34,14.99 21.34,15.49 21.08,15.75 20.57,15.75 20.32,15.49 20.32,12.95 19.56,12.19 17.02,12.19 16.76,11.94 16.76,11.43 17.02,11.18 17.53,11.18 17.78,10.92 17.78,10.41 18.03,10.16 20.83,10.16 20.83,11.43 21.08,11.68
N$102
  cutout Bottom: 20.83,9.14 17.78,9.14 17.65,9.02 17.65,8.26 17.53,8.13 16.76,8.13 16.64,8 16.64,7.37 16.76,7.24 18.92,7.24 19.3,6.86 19.3,5.84 19.56,5.59 20.07,5.59 20.32,5.33 20.32,5.08 20.57,4.83 22.1,4.83 22.35,5.08 22.35,7.62 21.08,7.62 20.83,7.87
N$103
  cutout Route15: 22.35,25.4 21.08,25.4 20.83,25.15 20.83,23.88 18.03,23.88 17.78,24.13 17.78,24.64 17.53,24.89 16.89,24.89 16.76,25.02 16.76,25.78 16.89,25.91 19.56,25.91 20.32,26.67 20.32,29.21 20.57,29.46 21.08,29.46 21.34,29.21 21.34,28.7 21.59,28.45 22.1,28.45 22.35,28.19
N$104
  cutout Route15: 20.83,22.86 18.03,22.86 17.78,22.61 17.78,22.1 17.53,21.84 16.76,21.84 16.76,20.83 19.05,20.83 19.3,20.57 19.3,19.56 19.56,19.3 20.07,19.3 20.32,19.05 20.32,18.54 20.57,18.29 22.1,18.29 22.35,18.54 22.35,21.34 21.08,21.34 20.83,21.59
N$105
  cutout Route15: 20.83,22.86 18.03,22.86 17.78,22.61 17.78,22.1 17.53,21.84 16.76,21.84 16.76,20.83 19.05,20.83 19.3,20.57 19.3,19.56 19.56,19.3 20.07,19.3 20.32,19.05 20.32,18.54 20.57,18.29 22.1,18.29 22.35,18.54 22.35,21.34 21.08,21.34 20.83,21.59
N$106
  cutout Route15: 22.35,11.68 21.08,11.68 20.83,11.43 20.83,10.16 18.03,10.16 17.78,10.41 17.78,10.92 17.53,11.18 17.02,11.18 16.76,11.43 16.76,11.94 17.02,12.19 19.56,12.19 20.32,12.95 20.32,15.49 20.57,15.75 21.08,15.75 21.34,15.49 21.34,14.99 21.59,14.73 22.1,14.73 22.35,14.48
N$107
  cutout Route15: 20.83,9.14 17.78,9.14 17.65,9.02 17.65,8.26 17.53,8.13 16.76,8.13 16.64,8 16.64,7.37 16.76,7.24 18.92,7.24 19.3,6.86 19.3,5.84 19.56,5.59 20.07,5.59 20.32,5.33 20.32,5.08 20.57,4.83 22.1,4.83 22.35,5.08 22.35,7.62 21.08,7.62 20.83,7.87
N$108
  Bottom 0.127: C110.1 R70.1
N$109
  Top 0.127: R62.1 LED1.A
OPT_EN_VN  (via drill 0.25)
  Top 0.127: U10.12 49.68,18.31 49.78,18.41 50.67,18.41 v50.93,18.67
  Route3 0.127: v19.81,4.06 19.81,2.16 20.45,1.52 21.72,1.52 22.23,2.03 30.35,2.03 30.73,1.65 31.75,1.65 32.26,2.16 36.2,2.16 41.15,7.11 41.15,7.37 41.66,7.87 v49.78,7.87
  Bottom 0.127: v19.81,4.06 18.16,4.06 18.03,3.94 18.03,3.43 18.15,3.32 U15.3 | v49.78,7.87 50.93,9.02 v50.93,18.67
OPT_EN_VP  (via drill 0.25)
  Top 0.127: 15.88,1.78 v15.88,1.52 15.88,1.91 15.76,2.02 U13.4 | U10.11 49.79,17.91 50.04,18.16 v51.44,18.16
  Route3 0.127: v15.88,1.52 16.26,1.52 16.38,1.4 20.07,1.4 20.32,1.14 21.84,1.14 22.35,1.65 30.23,1.65 30.61,1.27 31.88,1.27 32.38,1.78 36.45,1.78 40.39,5.71 48.77,5.71 v50.42,7.37
  Bottom 0.127: v50.42,7.37 51.44,8.38 v51.44,18.16
QSPI_SCLK
  Top 0.127: U9.6 46.1,10.16 45.97,10.29 45.97,10.92 46.72,11.67 U10.52
QSPI_SD0
  Top 0.127: U9.5 46.85,10.66 47.12,10.92 47.12,11.68 47.12,11.69 U10.53
QSPI_SD1
  Top 0.127: U9.2 50.3,9.66 50.55,9.91 50.55,11.43 50.04,11.94 48.26,11.94 47.92,12.28 U10.55
QSPI_SD2
  Top 0.127: U10.54 47.52,12.04 48.01,11.56 49.78,11.56 50.16,11.18 50.16,10.29 50.04,10.16 U9.3
QSPI_SD3
  Top 0.127: U9.7 45.97,9.66 45.72,9.91 45.72,11.18 46.32,11.78 U10.51
QSPI_SS_N
  Top 0.127: U9.1 50.43,9.16 50.93,9.65 | 50.93,9.65 50.93,11.68 50.29,12.32 48.51,12.32 48.32,12.51 U10.56 | 50.93,9.65 51.57,9.65 R57.2 R58.1
RUN  (via drill 0.25)
  Top 0.127: U10.26 43.92,20.47 43.18,21.21 40.01,21.21 38.23,22.99 v38.23,24.26 | J5.B7 v55.12,20.95 54.36,20.95 53.85,20.45 R59.1
  Route14 0.127: v38.23,24.26 39.5,22.99 43.05,22.99 43.56,23.5 50.8,23.5 51.44,22.86 53.21,22.86 v55.12,20.95
SCLK_A1
  Top 0.127: U1.16 36.46,24.12 40.63,19.95 U10.28
SCLK_A2
  Top 0.127: U3.16 36.31,10.4 38.86,12.95 38.86,14.22 40.15,15.51 U10.38
SCLK_A3  (via drill 0.25)
  Top 0.127: U10.16 47.92,20.53 47.88,20.57 47.88,20.83 v47.75,20.95
  Bottom 0.127: U5.16 36.95,22.62 38.1,21.46 45.85,21.46 46.35,20.95 v47.75,20.95 48.39,20.32 48.64,20.32 49.15,19.81 J2.10
SCLK_A4  (via drill 0.25)
  Top 0.127: U10.34 41.75,17.11 41.66,17.02 40.39,17.02 v40.13,17.27
  Bottom 0.127: U7.16 36.32,8.89 40.13,12.7 v40.13,17.27
SDI_A1
  Top 0.127: U1.15 36.45,23.62 40.96,19.11 U10.29
SDI_A2
  Top 0.127: U3.15 36.32,9.9 39.24,12.83 39.24,14.1 40.26,15.11 U10.39
SDI_A3  (via drill 0.25)
  Top 0.127: U10.17 47.52,20.55 47.24,20.83 47.24,21.21 v47.62,21.59
  Bottom 0.127: U5.15 36.95,23.12 38.23,21.84 45.97,21.84 46.48,21.34 47.37,21.34 v47.62,21.59 48.64,21.59 49.15,21.08 J2.8
SDI_A4  (via drill 0.25)
  Top 0.127: U10.35 41.46,16.71 41.4,16.76 39.62,16.76 v39.5,16.89
  Bottom 0.127: U7.15 36.32,9.4 39.75,12.83 39.75,16.64 v39.5,16.89
SDOA_A1
  Top 0.127: U1.13 36.44,22.62 40.74,18.31 U10.31
SDOA_A2
  Top 0.127: U3.13 36.33,8.9 40.01,12.57 40.01,13.84 40.47,14.31 U10.41
SDOA_A3  (via drill 0.25)
  Top 0.127: U10.18 47.12,20.44 46.86,20.7 v46.86,22.23
  Bottom 0.127: U5.13 36.97,24.12 38.48,22.61 46.48,22.61 v46.86,22.23 46.99,22.35 48.13,22.35 48.39,22.61 48.39,22.86 48.9,23.37 49.59,23.37 J2.4
SDOA_A4  (via drill 0.25)
  Top 0.127: U10.36 41.35,16.31 41.15,16.51 40.39,16.51 40.26,16.38 v39.12,16.38
  Bottom 0.127: U7.13 36.31,10.4 38.73,12.83 38.73,16 v39.12,16.38
SDOB_A1
  Top 0.127: U1.14 36.45,23.12 40.85,18.71 U10.30
SDOB_A2
  Top 0.127: U3.14 36.33,9.4 39.62,12.7 39.62,13.97 40.36,14.71 U10.40
SDOB_A3  (via drill 0.25)
  Top 0.127: v51.56,21.72 51.18,21.72 51.05,21.59 51.05,19.81 50.67,19.43 50.04,19.43 49.72,19.11 U10.14
  Bottom 0.127: U5.14 36.96,23.62 38.35,22.23 46.1,22.23 46.61,21.72 47.12,21.72 47.5,22.1 49.59,22.1 J2.6 50.55,22.35 51.18,21.72 v51.56,21.72
SDOB_A4  (via drill 0.25)
  Top 0.127: U10.13 50.08,18.71 v50.29,18.92
  Route14 0.127: v39.24,15.62 40.64,17.02 40.64,17.65 44.45,21.46 45.85,21.46 48.39,18.92 v50.29,18.92
  Bottom 0.127: U7.14 36.32,9.91 39.24,12.83 v39.24,15.62
SWCLK  (via drill 0.25)
  Top 0.127: U10.24 44.72,20.56 43.31,21.97 42.16,21.97 41.66,22.48 41.66,23.37 | 41.66,23.37 J3.1 | J5.B6 v55.12,22.23 | v42.67,23.5 41.78,23.5 41.66,23.37
  Route14 0.127: v55.12,22.23 53.47,23.88 43.05,23.88 v42.67,23.5
SWDIO  (via drill 0.25)
  Top 0.127: U10.25 44.32,20.58 43.31,21.59 40.77,21.59 39.37,22.99 39.37,23.75 J3.3 39.37,24.26 v40.13,24.26 | J5.B5 v55.12,23.5
  Route14 0.127: v55.12,23.5 54.36,24.26 v40.13,24.26
V1P1  (via drill 0.25)
  Top 0.127: v43.81,12.06 43.81,12.19 43.92,12.3 U10.45 | TP21.P$1 44.32,21.59 v44.96,20.95 45.12,20.79 U10.23 | U10.50 45.92,12.01 v45.85,11.94
  Route14 0.406: v43.81,12.06 43.81,13.08 | 43.81,13.08 43.81,19.81 v44.96,20.95 | v45.85,11.94 45.85,12.45 45.21,13.08 43.81,13.08
  Bottom 0.203: C91.1 43.81,13.09 v43.81,12.06 | C97.1 45.85,13.09 v45.85,11.94 | C96.1 44.96,19.8 v44.96,20.95
V3P3  (via drill 0.25)
  Top 0.127: R65.1 v41.66,9.14 | R58.2 v53.59,10.41 | U10.33 41.29,17.51 v41.27,17.53 | U10.44 43.52,12.53 43.18,12.19 v43.18,11.81 | U10.42 41.34,13.91 v41.27,13.84 | U10.22 45.52,20.88 v45.59,20.95 | U10.10 49.77,17.51 49.78,17.53 50.16,17.53 v50.29,17.65 | U10.1 50.1,13.91 v50.16,13.84 | U10.48 45.12,12.16 v45.21,12.06 45.52,12.37 U10.49 | R59.2 v54.6,18.55 v54.61,18.54 | U9.8 45.78,9.16 v45.77,9.14
  Top 0.203: U1.2 34.29,26.03 34.54,26.29 34.54,26.68 C7.1 | U3.2 34.29,11.93 34.42,12.06 34.42,12.58 C28.1 | J5.B16 v55.12,9.53
  Top 0.254: TP17.P$1 v47.37,29.08 | C28.1 35.68,13.09 35.69,13.08
  Top 0.305: C7.1 34.68,26.8 35.56,26.8 36.45,27.69 v37.08,27.69 | 35.69,13.08 36.58,13.97 v37.08,13.97
  Bottom 0.203: U5.2 34.29,20.96 34.54,20.7 34.54,20.31 C49.1 | U7.2 34.29,7.37 34.54,7.11 34.54,6.47 C70.1 | C101.1 v41.27,17.53 | C92.1 43.18,11.29 v43.18,11.81 | C99.1 49.01,17.65 v50.29,17.65 50.29,16.76 49.91,16.38 C113.1 | C100.1 45.59,19.93 v45.59,20.95 | C103.1 v41.27,13.84 | C98.1 44.96,12.32 v45.21,12.06 | v50.16,13.84 49.52,13.84 C102.1 | C85.1 46.53,9.91 v45.77,9.14
  Bottom 0.254: U11.1 48.51,28.33 C90.1 48.01,28.32 v47.37,28.32 v47.37,29.08 | C70.1 35.68,6.21 35.69,6.22
  Bottom 0.305: C49.1 37.08,20.06 v37.08,20.07 | 35.69,6.22 v36.2,6.22
  pour Route3 (isolate 0.203, rank 2, no thermals): 35.81,31.24 56.01,31.24 56.01,5.08 35.81,5.08
  pour Route14 (isolate 0.203, rank 2, no thermals): 35.81,31.24 56.01,31.24 56.01,5.08 35.81,5.08
V3P3A  (via drill 0.25)
  Top 0.203: U1.4 33.29,25.52 C6.1 | U2.9 22.61,20.44 22.86,20.19 | 22.86,20.19 C8.1 23.37,19.05 v23.37,17.4 | U2.10 23.11,20.44 22.86,20.19 | U6.4 19.93,23.62 v19.68,23.37 | v19.68,23.37 C61.1 | U6.3 19.93,23.12 v19.68,23.37 | U4.9 22.61,6.85 22.86,6.6 | 22.86,6.6 C29.1 23.37,5.33 v23.37,4.06 | U4.10 23.11,6.85 22.86,6.6 | U8.4 19.93,9.9 v19.68,9.65 | v19.68,9.65 C82.1 | U8.3 19.93,9.4 v19.68,9.65 | U3.4 33.29,11.8 32.89,12.19 | 32.89,12.19 | 32.89,12.19 C27.1
  Top 0.254: v38.48,28.45 TP18.P$1 | C6.1 32.48,26.14 v32.13,25.78 | C27.1 32.48,12.42 v32.13,12.06
  Bottom 0.203: U5.4 33.29,21.22 32.77,20.7 32.77,20.45 C48.1 | U6.9 22.61,26.29 22.86,26.54 | 22.86,26.54 C50.1 23.37,27.69 v23.37,29.34 | U6.10 23.11,26.29 22.86,26.54 | U6.4 19.93,23.62 v19.68,23.37 | U6.3 19.93,23.12 v19.68,23.37 | C61.1 v19.68,23.37 | U8.9 22.61,12.45 22.86,12.7 | 22.86,12.7 C71.1 23.37,14.11 v23.37,15.37 | U8.10 23.11,12.45 22.86,12.7 | U8.4 19.93,9.9 v19.68,9.65 | U8.3 19.93,9.4 v19.68,9.65 | C82.1 v19.68,9.65 | U7.4 33.29,7.5 32.64,6.86 32.48,6.7 C69.1 | C95.1 40.76,28.45 40.13,28.45 | C111.1 v29.98,18.15 v29.97,18.16
  Bottom 0.254: U12.1 41.14,28.33 C95.1 | 32.77,20.7 v32.38,21.08 | 32.64,6.86 v32.26,7.24
  Bottom 0.406: 40.13,28.45 v38.48,28.45 37.97,28.45 35.43,30.99 v33.02,30.99 v32.26,30.99
  pour Route3 (isolate 0.203): 22.61,31.24 33.27,31.24 33.27,1.27 22.61,1.27 22.61,7.87 21.34,7.87 21.08,8.13 21.08,9.27 19.56,9.27 19.56,10.03 21.08,10.03 21.08,11.18 21.34,11.43 22.61,11.43 22.61,21.59 21.34,21.59 21.08,21.84 21.08,22.99 19.56,22.99 19.56,23.75 21.08,23.75 21.08,24.89 21.34,25.15 22.61,25.15
V5P0  (via drill 0.25)
  Top 0.305: C88.1 v53.09,27.43 D1.C | D2.C 50.29,27.43
  Top 0.61: v53.85,27.43 v53.09,27.43 50.29,27.43 TP22.P$1 v47.24,27.43 v46.48,27.43
  Bottom 0.127: U12.5 45.73,29.83 45.85,29.72 45.85,28.7 45.97,28.57 | U11.5 53.1,29.83 53.21,29.72 53.21,28.7 53.34,28.57
  Bottom 0.254: C94.1 45.97,28.57 45.73,28.33 U12.8 | U11.8 53.1,28.33 53.34,28.57 C89.1
  Bottom 0.305: C94.1 v46.48,27.43 v47.24,27.43 | v53.09,27.43 v53.85,27.43 C89.1
V5P0_IN
  Top 0.254: J5.A3 58.04,26.04 58.67,26.67 58.67,27.94 58.17,28.45 58.17,28.57 | 58.17,28.57 58.17,29.21 57.91,29.46 54.86,29.46 54.86,28.57 | J5.B1 54.86,28.57 | J5.B3 55.12,26.04 54.48,26.67 54.48,28.19 54.86,28.57 | J5.A1 58.17,28.57
  Top 0.305: D1.A 53.27,29.78 53.59,29.46
  Top 0.406: 53.59,29.46 54.86,29.46
V6P5
  Top 0.127: 12.7,3.56 12.45,3.56 R66.2
  Top 0.254: U13.1 12.94,3.32 12.7,3.56 12.7,4.53 LF1.2 13.12,4.45 C105.1
V6P5CON
  Top 0.254: TP2.P$1 11.94,29.08 3.3,29.08 2.03,27.81 2.03,26.67
  Top 0.305: J1.1 2.03,26.67 | J1.5 2.03,24.13 | J1.9 2.03,21.59 | J1.13 2.03,19.05 | J1.17 2.03,16.51 | J1.21 2.03,13.97 | J1.25 2.03,11.43 | J1.29 2.03,8.89 | R71.1 11.3,5.59 11.3,4.74 LF1.1
  Top 0.406: 9.4,4.06 10.63,4.06 LF1.1
  Top 1.016: 2.03,26.67 2.03,24.13 2.03,21.59 2.03,19.05 2.03,16.51 2.03,13.97 2.03,11.43 2.03,8.89 2.03,5.33 3.3,4.06 9.4,4.06
V9P0
  Top 0.254: U13.6 15.86,3.32 15.88,3.3
  Top 0.305: R71.2 15.11,5.84 15.88,5.08 15.88,3.3 15.88,2.92 16.76,2.03 C104.1
  Top 0.406: C104.1 16.77,2.02 17.4,1.4 35.56,1.4 35.69,1.52 36.32,1.52 40.26,5.46 52.96,5.46 55.12,3.3 58.04,3.3 58.8,4.06 58.8,6.48 58.29,6.99 J5.A18
VBUS  (via drill 0.25)
  Top 0.254: J4.1 43.66,7.65 v42.93,8.38
  Top 0.305: 51.05,25.4 50.74,25.4 D2.A
  Top 0.406: v51.82,26.16 51.05,25.4
  Bottom 0.406: v42.93,8.38 47.75,8.38 50.29,5.84 52.83,5.84 55.88,8.89 55.88,25.4 55.12,26.16 v51.82,26.16
VN1P2  (via drill 0.25)
  Top 0.203: U6.16 25.66,23.12 v25.91,23.37 | v25.91,23.37 26.55,23.37 C10.1 | U6.15 25.66,23.62 v25.91,23.37 | U2.21 23.11,26.29 22.86,26.54 | U2.22 22.61,26.29 22.86,26.54 | C21.1 22.87,27.19 | v24,28.96 24,28.19 C21.1 | U4.22 22.61,12.45 22.86,12.7 | 22.86,12.7 C42.1 | U4.21 23.11,12.45 22.86,12.7 | U8.15 25.66,9.9 v25.91,9.65 | v25.91,9.65 26.55,9.65 C31.1 | U8.16 25.66,9.4 v25.91,9.65 | 22.86,26.54 22.86,27.06 C21.1
  Top 0.254: C42.1 24,14.74 v24,15.37
  Top 0.305: TP19.P$1 29.46,30.99 v28.45,30.99
  Bottom 0.127: U14.2 28.07,2.67 27.94,2.54 27.94,2.16
  Bottom 0.203: U6.16 25.66,23.12 v25.91,23.37 | U6.15 25.66,23.62 v25.91,23.37 | v25.91,23.37 26.16,23.62 26.42,23.62 C52.1 | U6.21 23.11,20.44 22.86,20.19 | 22.86,20.19 C63.1 24,18.41 v24,17.78 | U6.22 22.61,20.44 22.86,20.19 | U8.22 22.61,6.85 22.86,6.6 | 22.86,6.6 C84.1 | U8.21 23.11,6.85 22.86,6.6 | U8.15 25.66,9.9 v25.91,9.65 | U8.16 25.66,9.4 v25.91,9.65 | C73.1 v25.91,9.65 | C112.2 v29.21,16.38
  Bottom 0.254: U14.1 28.08,2.02 27.94,2.16 27.31,2.16 | 27.31,2.16 C107.2 | C84.1 24,4.69 v24,4.06 | 27.31,2.16 26.67,2.16 v26.29,2.54
  Bottom 0.305: v26.29,2.54 v25.65,2.54
  pour Route14 (isolate 0.203): 23.37,31.24 33.27,31.24 33.27,1.27 23.37,1.27
VN3P0  (via drill 0.25)
  Top 0.254: C106.2 32.25,2.16
  Top 0.305: 32.25,2.16 v31.37,2.16
  Top 0.406: v58.04,5.71 J5.A19
  Bottom 0.127: U14.3 28.18,3.32 28.07,3.43 28.07,3.68 28.32,3.94 28.7,3.94
  Bottom 0.254: U14.6 31.23,2.02 v31.37,2.16 | 31.75,1.78 32.13,2.16 32.13,3.05 31.24,3.94 29.72,3.94 | 29.72,3.94 28.7,3.94 | U14.PAD 29.72,3.94
  Bottom 0.305: 32.51,1.52 32,1.52 31.75,1.78 v31.37,2.16
  Bottom 0.406: 32.51,1.52 36.32,1.52 40.26,5.46 49.4,5.46 49.78,5.08 57.4,5.08 v58.04,5.71
  pour Bottom (isolate 0.203, no thermals): 28.7,5.08 30.99,5.08 30.99,3.94 30.23,3.94 30.23,1.27 29.21,1.27 29.21,3.94 28.7,3.94
VN20P0  (via drill 0.25)
  Top 0.305: C109.2 18.68,2.16 v17.78,2.16 17.78,4.7 17.14,5.33 16.51,5.33 14.86,6.99 LF2.2
  Bottom 0.127: v17.78,2.16 C110.2 R69.1
  Bottom 0.254: U15.1 17.92,2.02 v17.78,2.16
VN20P0CON  (via drill 0.25)
  Top 0.254: TP3.P$1 13.34,28.45 7.37,28.45 6.35,27.43 v6.35,26.67
  Top 0.305: J1.2 v6.35,26.67 | J1.6 v6.35,24.13 | J1.10 v6.35,21.59 | J1.14 v6.35,19.05 | J1.18 v6.35,16.51 | J1.22 v6.35,13.97 | J1.26 v6.35,11.43 | J1.30 v6.35,8.89
  Top 0.406: v7.49,5.33 v8.26,5.33 10.16,5.33 10.41,5.59 10.41,6.48 10.92,6.99 LF2.1
  Bottom 0.305: v6.35,26.67 5.08,25.4 | v6.35,24.13 5.08,24.13 | v6.35,21.59 5.08,21.59 | v6.35,19.05 5.08,19.05 | v6.35,16.51 5.59,16.51 5.08,16 | v6.35,13.97 5.08,13.97 | v6.35,11.43 5.08,11.43 | v6.35,8.89 5.08,8.89
  Bottom 0.406: v8.26,5.33 v7.49,5.33 6.35,5.33
  Bottom 0.61: 5.08,6.6 6.35,5.33
  Bottom 1.016: 5.08,25.4 5.08,24.13 5.08,21.59 5.08,19.05 5.08,16 5.08,13.97 5.08,11.43 5.08,8.89 5.08,6.6
VN22  (via drill 0.25)
  Top 0.305: C108.2 22.09,2.03 v21.21,2.03
  Top 0.406: v54.99,4.45 J5.B20
  Route14 0.305: 21.84,1.4 v21.21,2.03
  Route14 0.406: 21.84,1.4 35.56,1.4 35.69,1.52 36.32,1.52 40.26,5.46 53.98,5.46 v54.99,4.45
  Bottom 0.254: U15.6 21.19,2.02 v21.21,2.03 21.21,1.27 19.56,1.27 U15.PAD
  pour Bottom (isolate 0.203, no thermals): 19.05,3.81 20.07,3.81 20.07,0.89 18.29,0.89 18.29,1.52 19.05,1.52
VOCM_A1  (via drill 0.25)
  Top 0.203: U2.17 25.9,24.12 v25.91,24.13 C20.1 | R14.2 36.18,19.06 R13.1 35.18,18.03 34.67,17.53 | U2.11 23.61,20.33 23.88,20.07 C9.1 24.39,19.55 24.77,19.18
  Top 0.305: 34.67,17.53 v28.96,17.53 TP5.P$1 24.77,19.18
  Route3 0.305: v28.96,17.53 26.92,19.56 26.92,23.75 26.54,24.13 v25.91,24.13
VOCM_A2  (via drill 0.25)
  Top 0.203: U4.11 23.61,6.49 23.75,6.35 23.75,5.96 C30.1 23.88,5.84 24.51,5.84 24.89,5.46 | U4.17 25.9,10.4 v25.91,10.41 C41.1 | R28.2 36.18,5.21 R27.1 35.18,4.19 34.8,3.81
  Top 0.305: 24.89,5.46 TP8.P$1 28.7,3.94 28.96,4.19 32.26,4.19 32.64,3.81 34.8,3.81
  Route3 0.305: v25.91,10.41 26.42,10.41 26.92,9.91 26.92,5.71 26.42,5.21 TP8.P$1
  other vias: 26.42,3.94
VOCM_A3  (via drill 0.25)
  Route3 0.305: v25.91,22.73 25.4,22.73 25.15,22.99 25.15,27.18 v24.77,27.56
  Bottom 0.203: 34.81,27.8 R41.1 35.31,28.19 | 35.31,28.19 35.31,29.08 35.05,29.34 34.67,29.34 | U6.17 25.79,22.62 v25.91,22.73 26.42,22.73 C62.1 | U6.11 23.61,26.4 23.88,26.67 C51.1 24.39,27.19 v24.77,27.56 | 35.31,28.19 35.56,28.19 R42.2
  Bottom 0.305: 34.67,29.34 TP12.P$1 v24.77,27.56
  other vias: 26.54,29.34
VOCM_A4  (via drill 0.25)
  Route3 0.305: v25.91,8.89 25.27,8.89 24.89,9.27 v24.89,14.22
  Bottom 0.203: U8.11 23.61,13.33 C72.1 24.25,13.97 24.64,13.97 v24.89,14.22 | U8.17 25.9,8.9 v25.91,8.89 26.16,9.14 26.42,9.14 C83.1 | R55.1 35.31,14.48 | 35.31,14.48 35.55,14.48 R56.2 | 35.31,14.48 35.31,15.11
  Bottom 0.305: 35.31,15.11 34.67,15.75 TP16.P$1 v24.89,14.22
  other vias: 26.42,15.75

## Text on the board
Bottom: BZ
tPlace: D
bPlace: ADC A3 / SPI Debug | D | NinjaNIRS 2026 / Detector Interface / v03 07/2026 | BZIM@BU.EDU
tNames: -1.2V | 3.3V | 3.3V | 6.5V | -20V | VcmA3 | 5V | D0 | SWDIO | SWCLK | D1 | 1.1V | D2 | D3 | VcmA1 | VcmA4 | D4 | D5 | D6 | GND | D7 | VcmA2 | BOOTSEL